# Altium schematic sheet LPCB235 - RM48 - SERIAL.SchDoc
size A3; Address1: Unit 4; DocumentNumber: 31; Revision: 2; SheetNumber: 31; SheetTotal: 37; Lockie__PCB_SUB_ASSEMBLY: Serial IO; Lockie__PCB_ASSEMBLY: FCU PCB; Lockie__LDL: LPCB235; Lockie__PCB_DESCRIPTION: Flight Control Unit
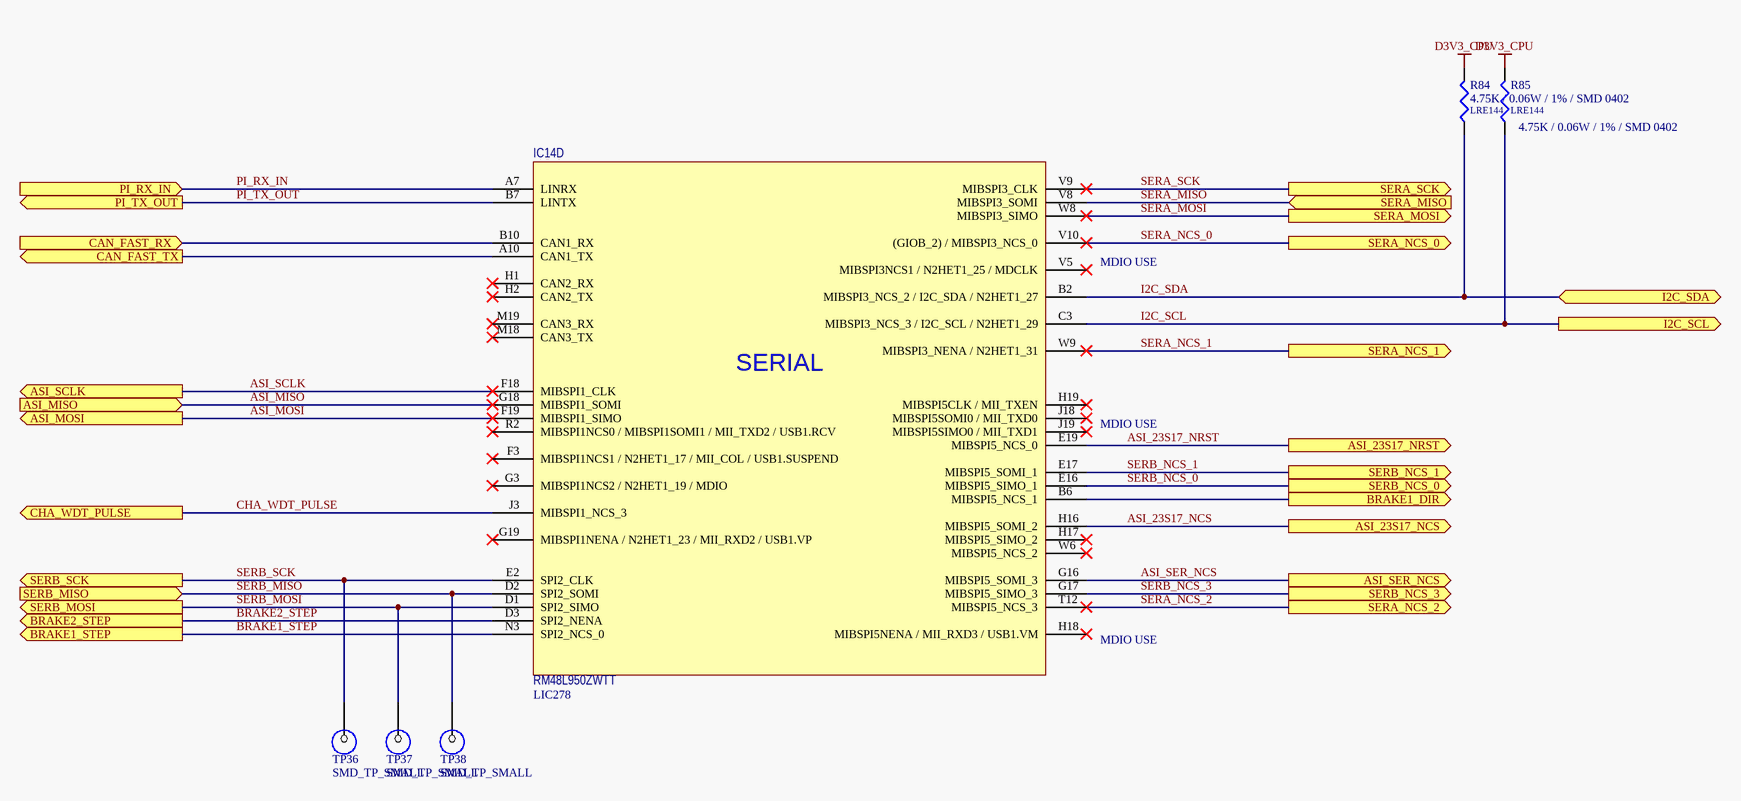
[diagram p0: LPCB235 - RM48 - SERIAL.SchDoc]

## Parts
IC14  RM48L950ZWTT  LDL_NUMBER: LIC278  [LFP054__ZWT (S-PBGA-N337)]  (part D of 10)
R84  4.75K / 0.06W / 1% / SMD 0402  LDL_NUMBER: LRE144  [LFP030__CR1005-0402-IPC7351]
R85  4.75K / 0.06W / 1% / SMD 0402  LDL_NUMBER: LRE144  [LFP030__CR1005-0402-IPC7351]
TP36  SMD_TP_SMALL  [SMD-TP-SMALL]  (no BOM)
TP37  SMD_TP_SMALL  [SMD-TP-SMALL]  (no BOM)
TP38  SMD_TP_SMALL  [SMD-TP-SMALL]  (no BOM)

## Ports
ASI_23S17_NCS (out), ASI_23S17_NRST (out), ASI_MISO (in), ASI_MOSI (out), ASI_SCLK (out), ASI_SER_NCS (out), BRAKE1_DIR (out), BRAKE1_STEP (out), BRAKE2_STEP (out), CAN_FAST_RX (in), CAN_FAST_TX (out), CHA_WDT_PULSE (out), I2C_SCL (out), I2C_SDA (bidir), PI_RX_IN (in), PI_TX_OUT (out), SERA_MISO (in), SERA_MOSI (out), SERA_NCS_0 (out), SERA_NCS_1 (out), SERA_NCS_2 (out), SERA_SCK (out), SERB_MISO (in), SERB_MOSI (out), SERB_NCS_0 (out), SERB_NCS_1 (out), SERB_NCS_3 (out), SERB_SCK (out)

## Nets
D3V3_CPU: R84.2 R85.2
ASI_23S17_NCS: IC14.H16(MIBSPI5_SOMI_2) ; port ASI_23S17_NCS
ASI_23S17_NRST: IC14.E19(MIBSPI5_NCS_0) ; port ASI_23S17_NRST
ASI_MISO: IC14.G18(MIBSPI1_SOMI) ; port ASI_MISO
ASI_MOSI: IC14.F19(MIBSPI1_SIMO) ; port ASI_MOSI
ASI_SCLK: IC14.F18(MIBSPI1_CLK) ; port ASI_SCLK
ASI_SER_NCS: IC14.G16(MIBSPI5_SOMI_3) ; port ASI_SER_NCS
BRAKE1_DIR: IC14.B6(MIBSPI5_NCS_1) ; port BRAKE1_DIR
BRAKE1_STEP: IC14.N3(SPI2_NCS_0) ; port BRAKE1_STEP
BRAKE2_STEP: IC14.D3(SPI2_NENA) ; port BRAKE2_STEP
CAN_FAST_RX: IC14.B10(CAN1_RX) ; port CAN_FAST_RX
CAN_FAST_TX: IC14.A10(CAN1_TX) ; port CAN_FAST_TX
CHA_WDT_PULSE: IC14.J3(MIBSPI1_NCS_3) ; port CHA_WDT_PULSE
I2C_SCL: IC14.C3(MIBSPI3_NCS_3_/_I2C_SCL_/_N2HET1_29) R85.1 ; port I2C_SCL
I2C_SDA: IC14.B2(MIBSPI3_NCS_2_/_I2C_SDA_/_N2HET1_27) R84.1 ; port I2C_SDA
PI_RX_IN: IC14.A7(LINRX) ; port PI_RX_IN
PI_TX_OUT: IC14.B7(LINTX) ; port PI_TX_OUT
SERA_MISO: IC14.V8(MIBSPI3_SOMI) ; port SERA_MISO
SERA_MOSI: IC14.W8(MIBSPI3_SIMO) ; port SERA_MOSI
SERA_NCS_0: IC14.V10((GIOB_2)_/_MIBSPI3_NCS_0) ; port SERA_NCS_0
SERA_NCS_1: IC14.W9(MIBSPI3_NENA_/_N2HET1_31) ; port SERA_NCS_1
SERA_NCS_2: IC14.T12(MIBSPI5_NCS_3) ; port SERA_NCS_2
SERA_SCK: IC14.V9(MIBSPI3_CLK) ; port SERA_SCK
SERB_MISO: IC14.D2(SPI2_SOMI) TP38.1 ; port SERB_MISO
SERB_MOSI: IC14.D1(SPI2_SIMO) TP37.1 ; port SERB_MOSI
SERB_NCS_0: IC14.E16(MIBSPI5_SIMO_1) ; port SERB_NCS_0
SERB_NCS_1: IC14.E17(MIBSPI5_SOMI_1) ; port SERB_NCS_1
SERB_NCS_3: IC14.G17(MIBSPI5_SIMO_3) ; port SERB_NCS_3
SERB_SCK: IC14.E2(SPI2_CLK) TP36.1 ; port SERB_SCK

Not connected (* = marked no-connect by the designer): IC14 F3(MIBSPI1NCS1_/_N2HET1_17_/_MII_COL_/_USB1.SUSPEND)* G3(MIBSPI1NCS2_/_N2HET1_19_/_MDIO)* G19(MIBSPI1NENA_/_N2HET1_23_/_MII_RXD2_/_USB1.VP)* H1(CAN2_RX)* H2(CAN2_TX)* H17(MIBSPI5_SIMO_2)* H18(MIBSPI5NENA_/_MII_RXD3_/_USB1.VM)* H19(MIBSPI5CLK_/_MII_TXEN)* J18(MIBSPI5SOMI0_/_MII_TXD0)* J19(MIBSPI5SIMO0_/_MII_TXD1)* M18(CAN3_TX)* M19(CAN3_RX)* R2(MIBSPI1NCS0_/_MIBSPI1SOMI1_/_MII_TXD2_/_USB1.RCV)* V5(MIBSPI3NCS1_/_N2HET1_25_/_MDCLK)* W6(MIBSPI5_NCS_2)*

## Notes on the sheet
- MDIO USE
- PCB COMPONENT DESCRIPTION
- LDL NUMBER
- Assembly Details
- Size
- Drawing File Name
- Revision
- http://rloop.org
- Scale
- A3
- Sheet Details
- N.T.S
- Sheet:
- Of:
- (in symbol RM48L950ZWTT, part D) SERIAL

## Library data of the parts
IC14 = RM48L950ZWTT: IC, CPU, RM48 Safety CPU, SMD NFBGA337 [LIC278]; FMEDA__FUNCTION_IN_SYSTEM: SAFETY CPU 1; FMEDA__OPERATING__TEMP_MIN: -20; FMEDA__OPERATING__TEMP_TYP: 27; FMEDA__OPERATING__TEMP_MAX: 50; FMEDA__CHANNEL: COM
R84 R85 = 4.75K / 0.06W / 1% / SMD 0402: Resistor, Ceramic Chip, 4.75K, 0.0625W, 1%, SMD 0402 [LRE144]; Value: 4750; FMEDA__OPERATING__POWER_MAX: 0; FMEDA__OPERATING__TEMP_MAX: 50; FMEDA__OPERATING__TEMP_MIN: -20; FMEDA__OPERATING__TEMP_TYP: 27; FMEDA__CHANNEL: COM; FMEDA__OPERATING__POWER_MIN: 0; FMEDA__OPERATING__VOLTAGE_MAX: 0; FMEDA__OPERATING__VOLTAGE_MIN: 0; FMEDA__OPERATING__VOLTAGE_TYP: 0; FMEDA__FUNCTION_IN_SYSTEM: *
TP36-TP38 = SMD_TP_SMALL: SMD Test Point; FMEDA__CHANNEL: COM; FMEDA__OPERATING__CURRENT_MAX: 0; FMEDA__OPERATING__TEMP_MAX: 50; FMEDA__OPERATING__TEMP_MIN: -20; FMEDA__OPERATING__TEMP_TYP: 27; FMEDA__OPERATING__VOLTAGE_MAX: 16; FMEDA__OPERATING__VOLTAGE_TYP: 12; FMEDA__OPERATING__CURRENT_MIN: 0; FMEDA__OPERATING__CURRENT_TYP: 0; FMEDA__OPERATING__VOLTAGE_MIN: 0